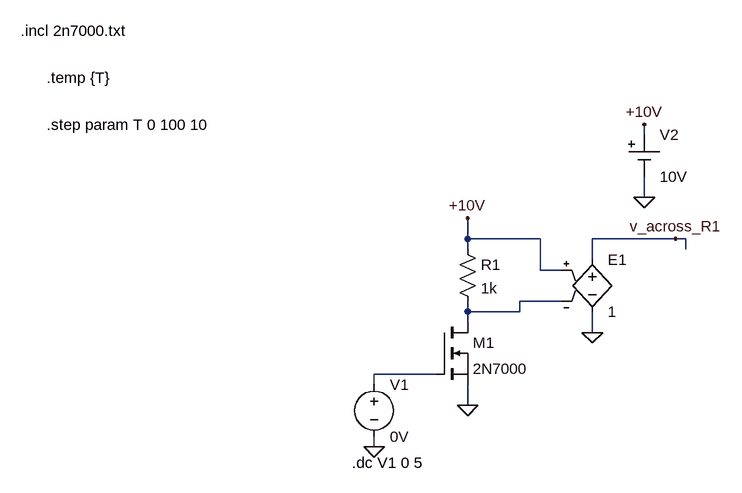
[diagram p0: schematic Lab 1 controlled source.asc]
Lab 1 controlled source.asc, the LTspice schematic file:
Version 4
SHEET 1 1600 1440
WIRE 496 -176 496 -192
WIRE 496 -80 496 -112
WIRE 224 -16 224 -48
WIRE 336 -16 224 -16
WIRE 544 -16 416 -16
WIRE 560 -16 544 -16
WIRE 224 0 224 -16
WIRE 560 0 560 -16
WIRE 416 16 416 -16
WIRE 336 32 336 -16
WIRE 368 32 336 32
WIRE 368 80 304 80
WIRE 224 96 224 80
WIRE 304 96 304 80
WIRE 304 96 224 96
WIRE 224 112 224 96
WIRE 416 128 416 96
WIRE 176 192 80 192
WIRE 80 208 80 192
WIRE 224 240 224 208
WIRE 80 304 80 288
FLAG 80 304 0
FLAG 224 240 0
FLAG 496 -80 0
FLAG 496 -192 +10V
FLAG 224 -48 +10V
FLAG 416 128 0
FLAG 544 -16 v_across_R1
SYMBOL nmos 176 112 R0
SYMATTR InstName M1
SYMATTR Value 2N7000
SYMBOL voltage 80 192 R0
WINDOW 123 0 0 Left 0
WINDOW 39 0 0 Left 0
SYMATTR InstName V1
SYMATTR Value 0V
SYMBOL res 208 -16 R0
SYMATTR InstName R1
SYMATTR Value 1k
SYMBOL Misc\\cell 496 -176 R0
WINDOW 123 0 0 Left 0
WINDOW 39 0 0 Left 0
SYMATTR InstName V2
SYMATTR Value 10V
SYMBOL e 416 0 R0
SYMATTR InstName E1
SYMATTR Value 1
TEXT 46 328 Left 2 !.dc V1 0 5
TEXT -464 -336 Left 2 !.incl 2n7000.txt
TEXT -424 -264 Left 2 !.temp {T}
TEXT -424 -192 Left 2 !.step param T 0 100 10

The netlist it stands for:
* Lab 1 controlled source.asc
M1 N001 N002 0 0 2N7000
V1 N002 0 0V
R1 +10V N001 1k
V2 +10V 0 10V
E1 v_across_R1 0 +10V N001 1
.model NMOS NMOS
.model PMOS PMOS
.lib standard.mos
.dc V1 0 5
.incl 2n7000.txt
.temp {T}
.step param T 0 100 10
.backanno
.end